# Altium schematic sheet Mechanical.SchDoc: Titel
size A4; DesignedDate: 01-01-12; CompanyName: DCI Electronics bv; Engineer: KRS; Organization: DCI Electronics; Address1: Nijverheidsstraat 14; Address2: 4458 AV Eindewege; Address3: Phone: +31 (0)113 344880; DocumentNumber: 4; Revision: 0; SheetNumber: 5; SheetTotal: 5; PageSetup: Record=PageOptions|CenterHorizontal=True|CenterVertical=True|PrintScale=1.00|XCorrection=1.00|YCorrection=1.00|PrintKind=1|BorderSize=5000000|LeftOffset=0|BottomOffset=0|Orientation=2|PaperLength=1000|PaperWidth=1000|Scale=100|PaperSource=7|PrintQuality=-4|MediaType=1|DitherType=10|PaperKind=ISO_A4_(210.00_x_297.00_MM)|PrintScaleMode=1; SubTitle: SubTitel; ApprovedDate: 01-01-12; DesignedBy: KRS; Designer: KRS
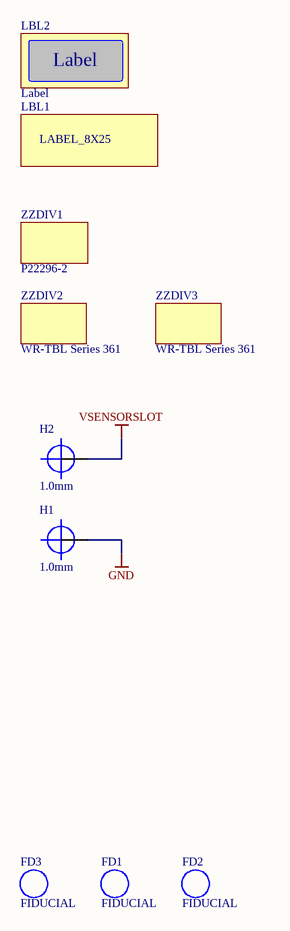
[diagram p0: Mechanical.SchDoc]

## Parts
FD1  FIDUCIAL  [fiducial1.5MM]
FD2  FIDUCIAL  [fiducial1.5MM]
FD3  FIDUCIAL  [fiducial1.5MM]
H1  1.0mm  [PTH_1.0_1.6]  (no BOM)
H2  1.0mm  [PTH_1.0_1.6]  (no BOM)
LBL1  (no value)  [Label_8x25]  (no BOM)
LBL2  Label  [LABEL_12.7X25.4]
ZZDIV1  P22296-2  (mechanical)
ZZDIV2  WR-TBL Series 361  (mechanical)
ZZDIV3  WR-TBL Series 361  (mechanical)

## Nets
GND: H1.0
VSENSORSLOT: H2.0

## Notes on the sheet
- Designed by:
- Drawing number:
- Variant:
- Date:
- Page:
- Rev:
- Of:
- Dekimo Goes B.V.
- Nijverheidsstraat 14, 4458 AV  Eindewege, Phone: +31 (0)113 344880

## Library data of the parts
H1 H2 = PTH-1.0: 1.0mm PTH; PartCode: PTH-1.0
LBL1 = LABEL_8X25
LBL2 = LBL STCK/20: Multi-funct labels12.7 x25.4mm; EngPartGrpMainCode: CASE; SMD_Flag: False; PartCode: LBL STCK/20; Type: Standard Label; ManufactpartCode: -; Preferred: False
ZZDIV1 = PCB P22296-2: MFM Sensor(druk); EngPartGrpMainCode: PCB; Preferred: False; PartCode: PCB P22296-2; Type: $PCB; ManufactpartCode: P22296-2; SMD_Flag: False
ZZDIV2 ZZDIV3 = CON STB4F/32 WE: Screw,4p,Fem,P3.81,Straight; EngPartGrpMainCode: CONN; ManufactpartCode: 691361300004-WE; Preferred: False; PartCode: CON STB4F/32 WE; Type: Plug terminal block; SMD_Flag: False